# EAGLE design alim26 (EAGLE 9.6.2)
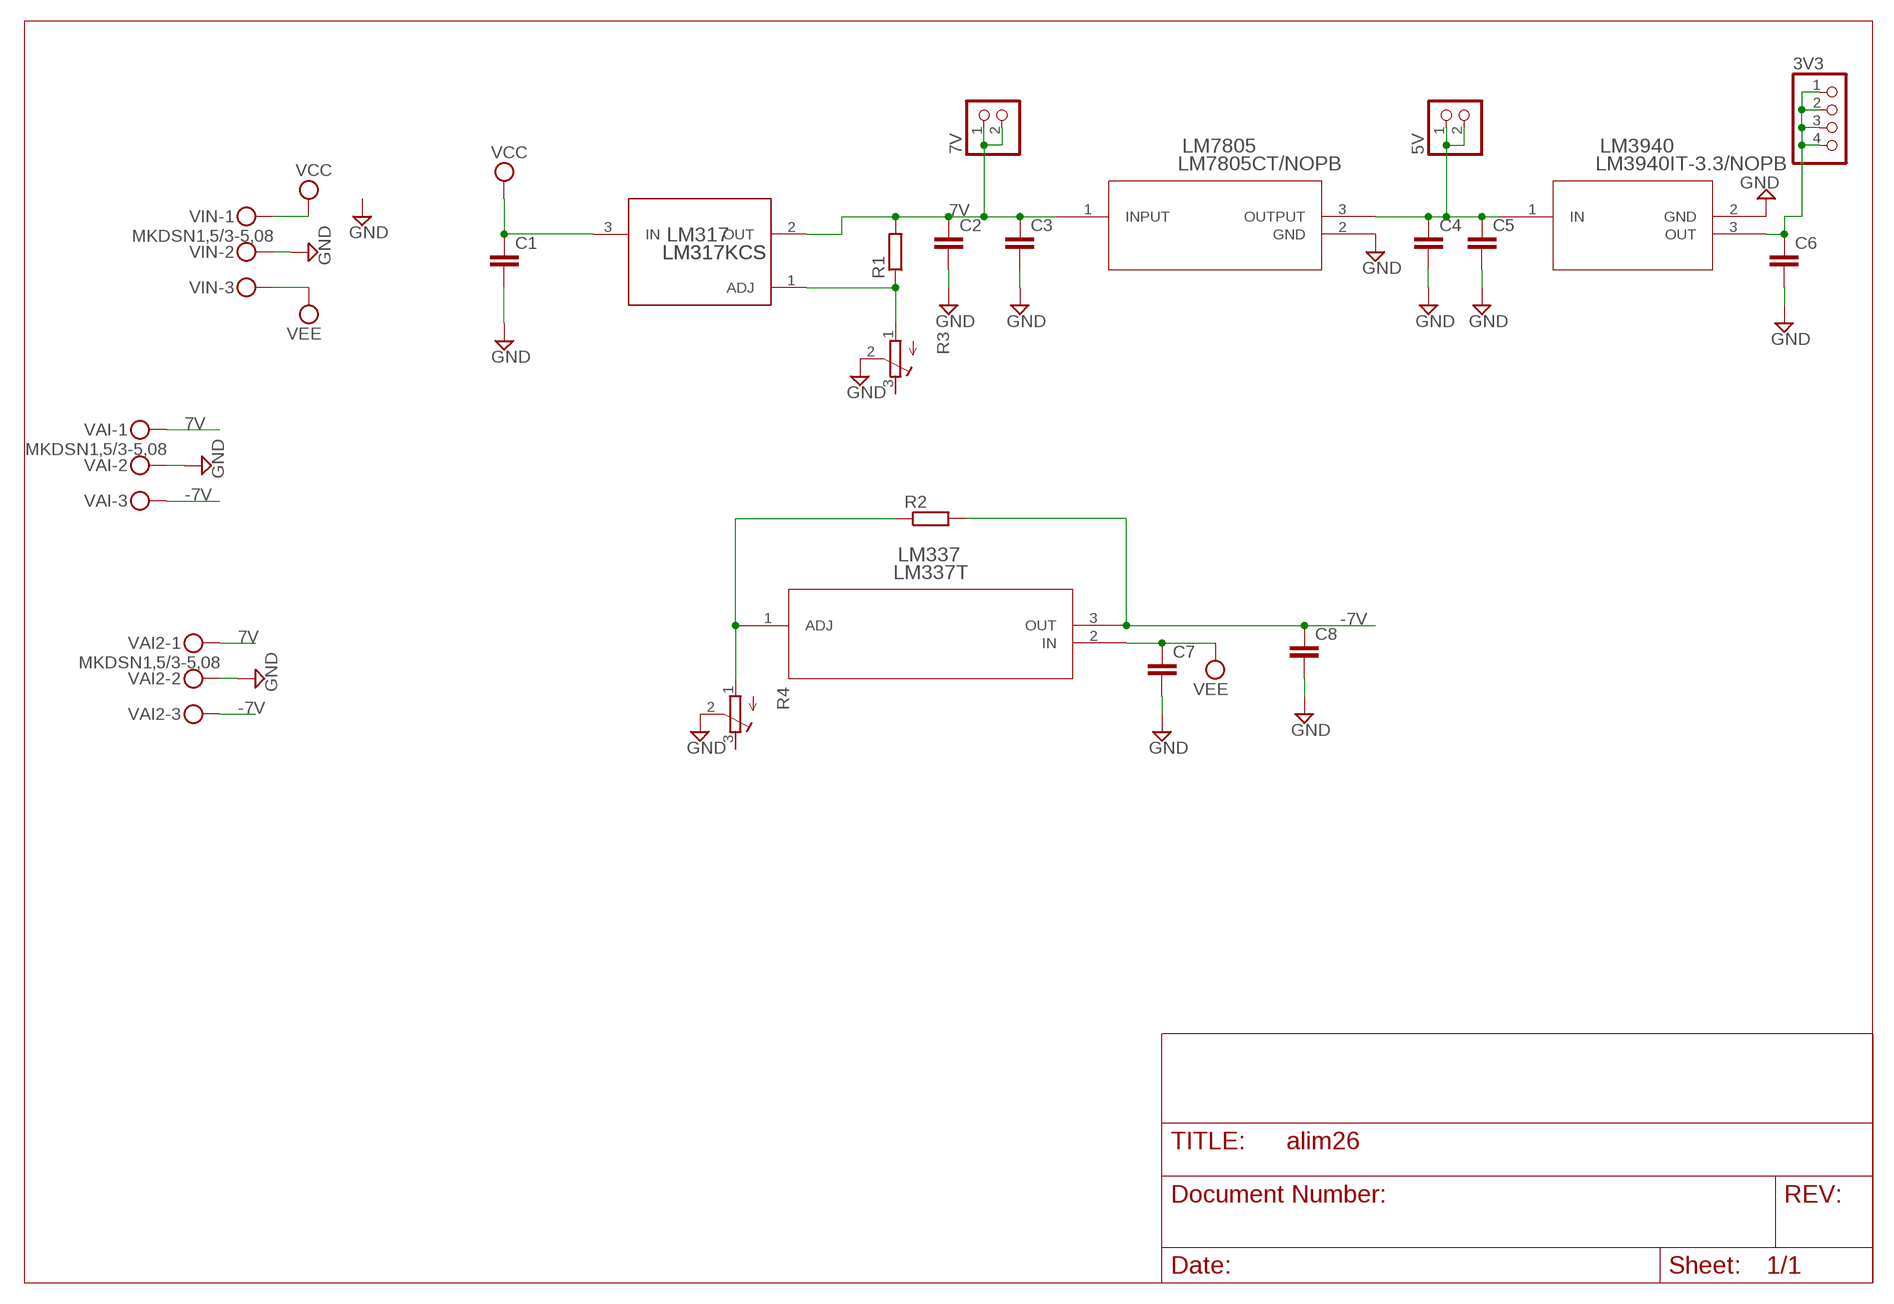
[diagram p0: schematic, sheet 1]

## Parts
3V3  PINHD-1X4  [1X04]
5V  PINHD-1X2  [1X02]
7V  PINHD-1X2  [1X02]
C1  C5/3  [C5B3]
C2  C5/3  [C5B3]
C3  C5/3  [C5B3]
C4  C5/3  [C5B3]
C5  C5/3  [C5B3]
C6  C5/3  [C5B3]
C7  C5/3  [C5B3]
C8  C5/3  [C5B3]
LM317  LM317KCS  [KCS0003A]
LM337  LM337T  [T03B_TEX]
LM3940  LM3940IT-3.3/NOPB  [T03B]
LM7805  LM7805CT/NOPB  [NDE3_TEX]
R1  R-EU_0207/10  [0207/10]
R2  R-EU_0207/10  [0207/10]
R3  R-TRIMM64Y  [RTRIM64Y]
R4  R-TRIMM64Y  [RTRIM64Y]
VAI  MKDSN1,5/3-5,08  [MKDSN1,5/3-5,08]
VAI2  MKDSN1,5/3-5,08  [MKDSN1,5/3-5,08]
VIN  MKDSN1,5/3-5,08  [MKDSN1,5/3-5,08]

## Nets
7V: 7V.1 7V.2 C2.1 C3.1 LM317.2(OUT) LM7805.1(INPUT) R1.2 VAI2.1 VAI.1
-7V: C8.1 LM337.3(OUT) R2.2 VAI2.3 VAI.3
GND: C1.2 C2.2 C3.2 C4.2 C5.2 C6.2 C7.2 C8.2 LM3940.2(GND) LM7805.2(GND) R3.2(S) R4.2(S) VAI2.2 VAI.2 VIN.2
N$2: LM317.1(ADJ) R1.1 R3.1(A)
N$4: 5V.1 5V.2 C4.1 C5.1 LM3940.1(IN) LM7805.3(OUTPUT)
N$5: 3V3.1 3V3.2 3V3.3 3V3.4 C6.1 LM3940.3(OUT)
N$6: LM337.1(ADJ) R2.1 R4.1(A)
VCC: C1.1 LM317.3(IN) VIN.1
VEE: C7.1 LM337.2(IN) VIN.3
Unconnected: R3.3(E) R4.3(E)

## Library data of the parts
3V3 = pinhead:PINHD-1X4: PIN HEADER
5V 7V = pinhead:PINHD-1X2: PIN HEADER
C1-C8 = capacitor-wima:C: CAPACITOR naming: grid - package width
LM317 = LM317:LM317KCS; COPYRIGHT: Copyright (C) 2026 Ultra Librarian. All rights reserved.; DATASHEET: https://www.ti.com/lit/gpn/lm317; DESCRIPTION: 1.5-A, 40-V, adjustable linear voltage regulator 3-TO-220 0 to 125; MANUFACTURER_NAME: Texas Instruments; MANUFACTURER_PART_NUMBER: LM317KCS; REFDES: RefDes; TYPE: TYPE
LM337 = LM337:LM337T; COPYRIGHT: Copyright (C) 2026 Ultra Librarian. All rights reserved.; DATASHEET: https://www.ti.com/lit/gpn/lm337-n; DESCRIPTION: 1.5-A, negative, adjustable linear voltage regulator 3-TO-220 0 to 125; MANUFACTURER_NAME: Texas Instruments; MANUFACTURER_PART_NUMBER: LM337T
LM3940 = LM3940IT:LM3940IT-3.3/NOPB; COPYRIGHT: Copyright (C) 2025 Ultra Librarian. All rights reserved.; MANUFACTURER_PART_NUMBER: LM3940IT-3.3/NOPB; MFR_NAME: Texas Instruments; TYPE: LM3940IT-3.3
LM7805 = LM7805:LM7805CT/NOPB; COPYRIGHT: Copyright (C) 2026 Ultra Librarian. All rights reserved.; DATASHEET: https://www.ti.com/lit/gpn/lm7800; DESCRIPTION: 1.5-A, 30-V, linear voltage regulator 3-TO-220 0 to 125; MANUFACTURER_NAME: Texas Instruments; MANUFACTURER_PART_NUMBER: LM7805CT/NOPB
R1 R2 = rcl:R-EU_: RESISTOR, European symbol; SPICEPREFIX: R
R3 R4 = rcl:R-TRIMM: Trimm resistor; SPICEMODEL: X; SPICEPREFIXL: POT
VAI VAI2 VIN = con-phoenix-508:MKDSN1,5/3-5,08: MKDSN 1,5/ 3-5,08 Printklemme Nennstrom: 13,5 A Nennspannung: 250 V Rastermaß: 5,08 mm Polzahl: 3 Anschlussart: Schraubanschluss Montage: Löten Anschlussrichtung Leiter/Platine: 0 ° Artikelnummer: 1729131 Source: http://eshop.phoenixcontact.com .. 1729131.pdf

## Net classes
0 default: width 0.711 mm, drill 0.711 mm, clearance 0.711 mm

## Board
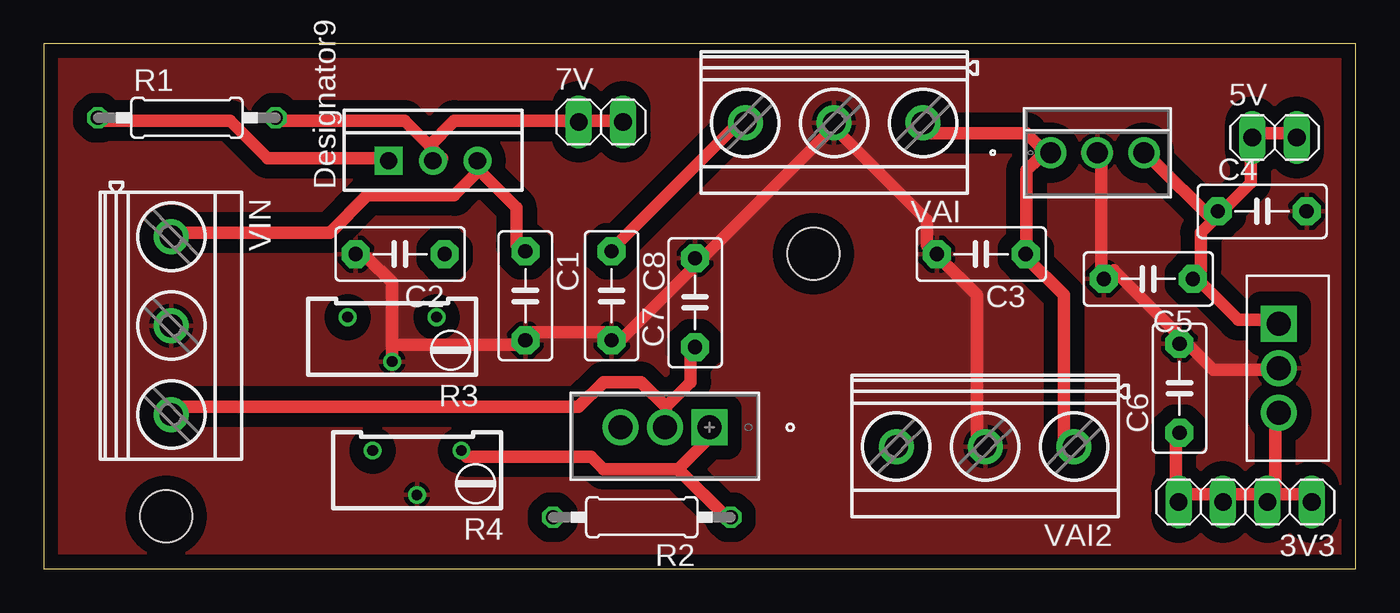
[diagram p1: board, top side]
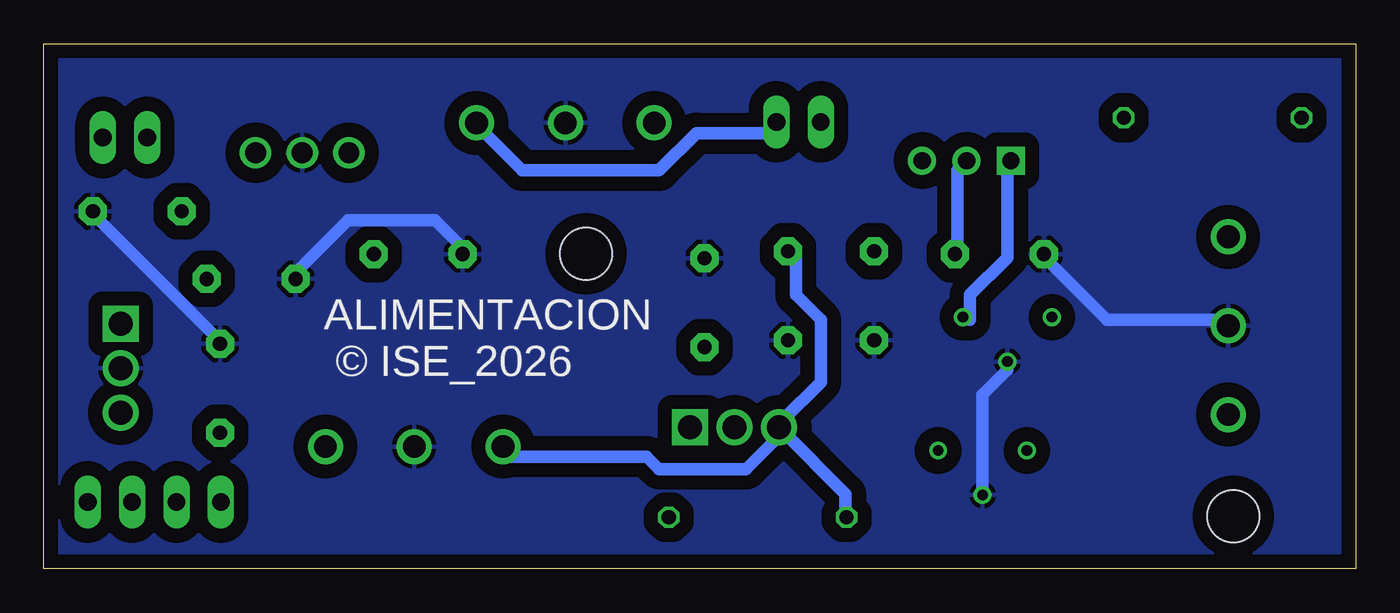
[diagram p2: board, bottom side, seen from below]

Size 75 x 30 mm. Coordinates in mm from the lower left corner, seen from the top.
Outline: 0,0 75,0 75,30 0,30 0,0
Copper layers (1*16): Top 0.035mm / dielectric 1.6mm / Bottom 0.035mm
Design rules "Eagle_9_5_DRU_median_rules_8mils_trace_space": minimum track width 8mil, minimum drill 12mil, track to track 8mil, track to pad 8mil, pad to pad 8mil, via to via 8mil, smd to smd 6mil, copper to edge 30mil, drill to drill 10mil, minimum pad ring 8mil, minimum via ring 6mil, stop-mask expansion 0mil, vias tented up to drill 100mil, thermal gap 10mil
Holes 3 mm at 7,3 44,18

### Footprints (pad centres in the part's own frame; a part is rotated, then mirrored left to right if it is on the bottom)
1X04 = drill 1.016 long: 1 -3.81,0; 2 -1.27,0; 3 1.27,0; 4 3.81,0
1X02 = drill 1.016 long: 1 -1.27,0; 2 1.27,0
C5B3 = drill 0.813 pad 1.6 octagon: 1 -2.54,0; 2 2.54,0
KCS0003A = drill 0.991 pad 1.6 square: 1 0,2.54 | drill 0.991 pad 1.6: 2 0,0; 3 0,-2.54
T03B_TEX = drill 1.372 pad 1.88 square: 1 0,0 | drill 1.372 pad 1.88: 2 2.54,0; 3 5.08,0
T03B = drill 1.372 pad 1.88 square: 1 -5.08,-1.016 | drill 1.372 pad 1.88: 2 -2.54,-1.016; 3 0,-1.016
NDE3_TEX = drill 1.194 pad 1.702: 1 0,0; 2 2.667,0; 3 5.334,0
0207/10 = drill 0.813 octagon: 1 -5.08,0; 2 5.08,0
RTRIM64Y = drill 0.61: 1 0,-2.54; 2 -2.54,0; 3 0,2.54
MKDSN1,5/3-5,08 = drill 1.3 pad 2: 1 -7.641,0.025; 2 -2.561,0.025; 3 2.519,0.025

### Placement (x,y rotation side)
3V3  68.68,3.81 180 top
5V  70.36,24.64 0 top
7V  31.85,25.53 0 top
C1  27.53,15.6 270 top
C2  20.37,17.98 180 top
C3  53.59,17.98 180 top
C4  69.65,20.42 0 top
C5  63.14,16.56 180 top
C6  64.92,10.31 90 top
C7  37.24,15.21 90 top
C8  32.46,15.6 270 top
LM317  22.25,23.32 90 top
LM337  38.05,8.08 180 top
LM3940  71.62,8.92 270 top
LM7805  57.56,23.77 0 top
R1  8.18,25.77 0 top
R2  34.19,2.95 180 top
R3  19.91,14.38 90 top
R4  21.34,6.76 90 top
VAI  42.62,25.5 180 top
VAI2  51.26,7.01 180 top
VIN  7.26,11.33 270 top

### Tracks (layer width: path | path; a pad name or v marks a point on that pad's centre or on a via)
7V
  Top 0.711: 30.58,25.6 32.72,25.6 7V.2 | 22.05,24.18 22.76,23.47 LM317.2 | 22.05,24.18 20.62,25.6 13.51,25.6 R1.2 | 30.58,25.6 23.47,25.6 22.05,24.18 | 30.58,25.6 7V.1 | VAI2.1 58.32,7.11 58.32,15.65 56.19,17.78 C3.1 56.19,18.49 56.19,22.76 56.9,23.47 LM7805.1 56.9,24.18 56.19,24.89 50.49,24.89 VAI.1
  Bottom 0.711: C2.1 22.76,18.49 22.76,22.76 LM317.2 | 7V.2 33.43,24.89 37.69,24.89 39.83,22.76 47.65,22.76 49.78,24.89 VAI.1
-7V
  Top 0.711: C8.1 32.72,18.49 39.83,25.6 VAI.3
  Bottom 0.711: 32.72,7.82 29.16,4.27 29.16,2.85 R2.2 | 32.72,7.82 34.85,5.69 39.83,5.69 40.54,6.4 48.36,6.4 VAI2.3 | 32.72,7.82 LM337.3 32.72,8.53 30.58,10.67 30.58,14.22 32,15.65 32,17.78 C8.1
GND
  Top 0.711: 19.91,12.8 19.91,16.36 18.49,17.78 C2.2 | 19.91,12.8 R3.2 | 19.91,12.8 27.03,12.8 C1.2 27.74,13.51 32,13.51 C8.2 32.72,12.8 36.98,17.07 C7.2 37.69,17.78 44.81,24.89 VAI.2 45.52,24.89 50.49,19.91 50.49,18.49 C3.2 51.21,17.78 53.34,15.65 53.34,7.11 VAI2.2 | LM7805.2 60.45,23.47 60.45,17.07 C5.2 61.16,17.07 64.72,13.51 C6.2 65.43,12.8 66.85,11.38 70.41,11.38 LM3940.2
  Bottom 0.711: R4.2 21.34,9.96 19.91,11.38 R3.2 | VIN.2 7.82,14.22 14.22,14.22 17.78,17.78 C2.2 | C4.2 71.83,19.91 64.72,12.8 C6.2 | C5.2 60.45,17.07 57.61,19.91 52.63,19.91 51.21,18.49 C3.2
  pour Top (isolate 0.813): 0,29.87 75.39,29.87 75.39,0 0,0
  pour Bottom (isolate 0.813): 0,29.87 75.39,29.87 75.39,0 0,0
N$2
  Top 0.711: R1.1 3.56,25.6 10.67,25.6 12.8,23.47 19.2,23.47 LM317.1
  Bottom 0.711: R3.1 22.05,14.22 22.05,15.65 19.91,17.78 19.91,22.76 LM317.1
N$4
  Top 0.711: 5V.2 71.12,24.89 69.7,24.89 5V.1 68.99,24.18 68.99,22.05 67.56,20.62 C4.1 66.85,19.91 | 66.85,19.91 66.14,19.2 66.14,17.07 C5.1 66.14,16.36 68.28,14.22 70.41,14.22 LM3940.1 | 66.85,19.91 63.3,23.47 LM7805.3
N$5
  Top 0.711: 70.41,4.27 71.83,4.27 3V3.1 | C6.1 64.72,7.11 64.72,4.27 3V3.4 65.43,4.27 66.85,4.27 3V3.3 67.56,4.27 69.7,4.27 3V3.2 70.41,4.27 | 70.41,4.27 70.41,8.53 LM3940.3
N$6
  Top 0.711: 36.27,5.69 32,5.69 31.29,6.4 24.18,6.4 R4.1 | 36.27,5.69 38.41,7.82 LM337.1 | 36.27,5.69 39.12,2.85 R2.1
VCC
  Top 0.711: 24.89,22.76 27.03,20.62 27.03,18.49 C1.1 | 24.89,22.76 23.47,21.34 18.49,21.34 16.36,19.2 7.82,19.2 VIN.1 | 24.89,22.76 LM317.3
VEE
  Top 0.711: 35.56,9.25 36.98,10.67 36.98,12.09 C7.1 | 35.56,9.25 35.56,8.53 LM337.2 | 35.56,9.25 34.14,10.67 32,10.67 30.58,9.25 7.82,9.25 VIN.3

### Text on the board
bNames: ALIMENTACION / © ISE_2026